# Altium schematic sheet MCU.SchDoc: Localisation sous marine
size A4; Author: Ali Zoubir; CompanyName: ETML-ES; Engineer: Ali Zoubir; Organization: ETML-ES; Revision: 0.0; SheetNumber: 2; SheetTotal: 6
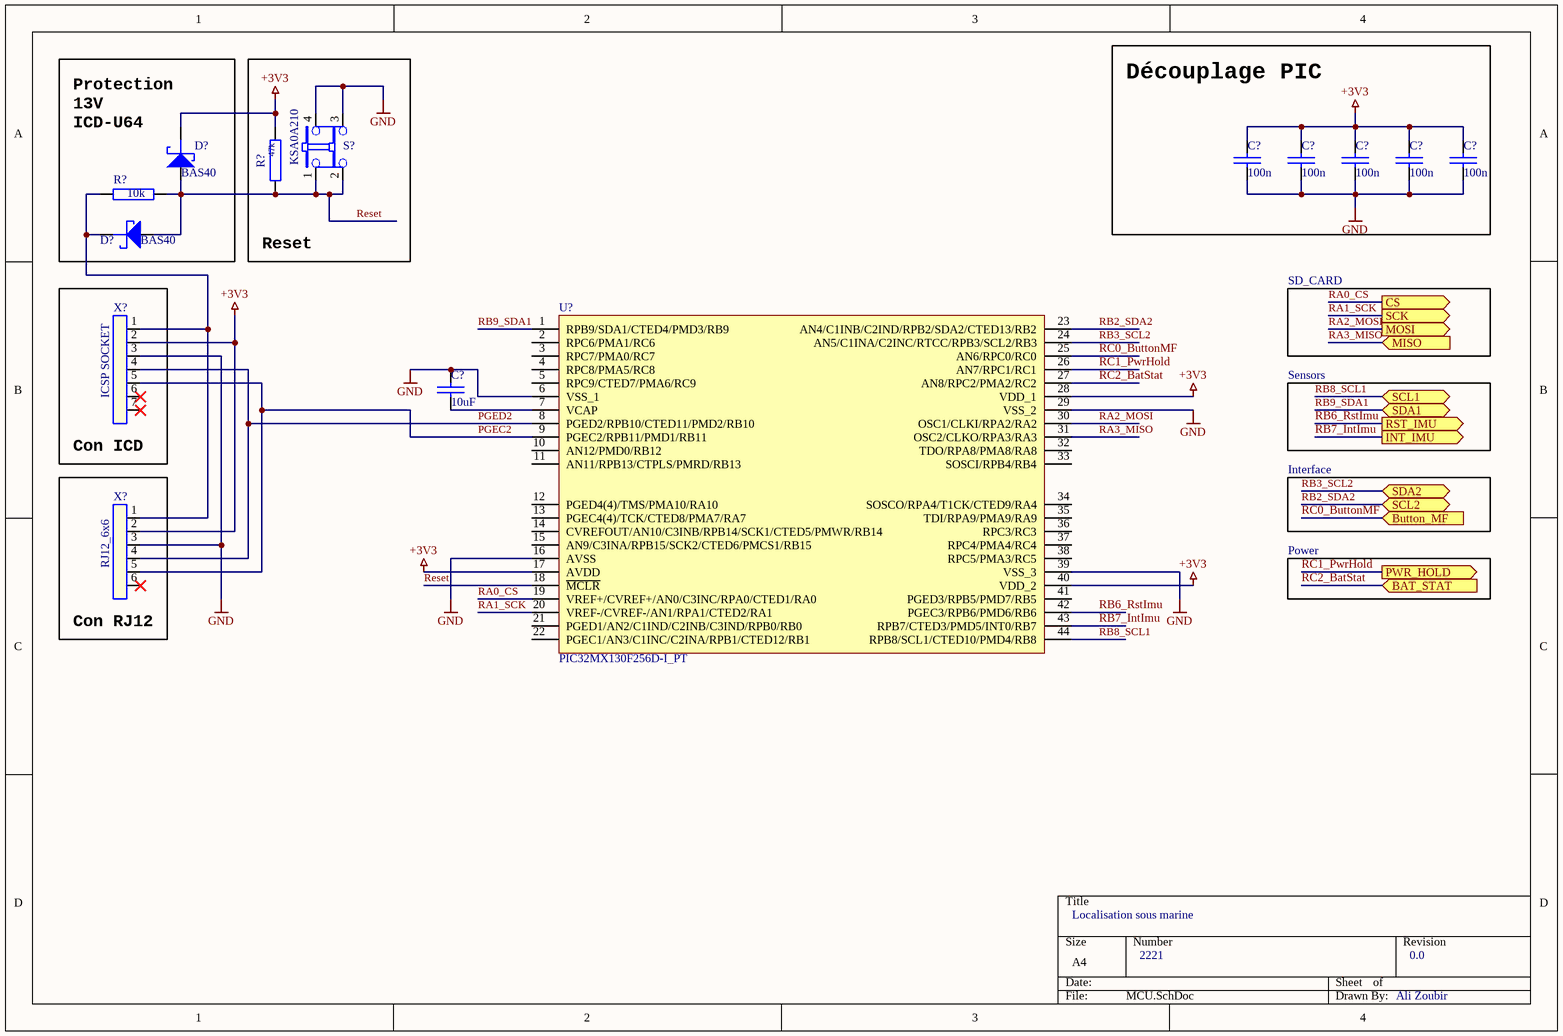
[diagram p0: MCU.SchDoc]

## Parts
(Parts that share a designator on the sheet are numbered #1, #2 ... from top to bottom, then left to right.)
C?#1  100n  [RC0805]
C?#2  100n  [RC0805]
C?#3  100n  [RC0805]
C?#4  100n  [RC0805]
C?#5  100n  [RC0805]
C?#6  10uF  [RC0805]
D?#1  BAS40  [BAS40]
D?#2  BAS40  [BAS40]
R?#1  47k  [RC0805]
R?#2  10k  [RC0805]
S?  KSA0A210  [6x6_mm_SMD_WS-TASV]
U?  PIC32MX130F256D-I_PT  [QFP80P1200X1200X120-44N]
X?#1  ICSP SOCKET  [Mini-berg1x7]
X?#2  RJ12_6x6  [RJ12_66_coude_verr_bas]

## Blocks framed on the sheet
Reset: R?#1 S?
Découplage PIC: C?#1-C?#5
Con ICD: X?#1
Con RJ12: X?#2

## Ports
BAT_STAT (in, see SchemaBloc[2B]), Button_MF (in, see SchemaBloc[3B], Interface[1A]), CS (out, see SchemaBloc[3B]), INT_IMU (out, see SchemaBloc[3B]), MISO (in, see SchemaBloc[3B]), MOSI (out, see SchemaBloc[3B]), PWR_HOLD (out, see SchemaBloc[2A]), RST_IMU (out, see SchemaBloc[3B]), SCK (out, see SchemaBloc[3B]), SCL1 (bidir, see SchemaBloc[3A]), SCL2 (bidir, see SchemaBloc[3B], Interface[1A]), SDA1 (bidir, see SchemaBloc[3A]), SDA2 (bidir, see SchemaBloc[3B], Interface[1A])

## Nets
+3V3: C?#1.1 C?#2.1 C?#3.1 C?#4.1 C?#5.1 D?#1.3(K) R?#1.1 U?.17(AVDD) U?.28(VDD_1) U?.40(VDD_2) X?#1.2 X?#2.2
GND: C?#1.2 C?#2.2 C?#3.2 C?#4.2 C?#5.2 C?#6.1 S?.3 S?.4 U?.6(VSS_1) U?.16(AVSS) U?.29(VSS_2) U?.39(VSS_3) X?#1.3 X?#2.3
PGEC2: U?.9(PGEC2/RPB11/PMD1/RB11) X?#1.5 X?#2.5
PGED2: U?.8(PGED2/RPB10/CTED11/PMD2/RB10) X?#1.4 X?#2.4
RA0_CS: U?.19(VREF+/CVREF+/AN0/C3INC/RPA0/CTED1/RA0) ; port CS
RA1_SCK: U?.20(VREF-/CVREF-/AN1/RPA1/CTED2/RA1) ; port SCK
RA2_MOSI: U?.30(OSC1/CLKI/RPA2/RA2) ; port MOSI
RA3_MISO: U?.31(OSC2/CLKO/RPA3/RA3) ; port MISO
RB2_SDA2: U?.23(AN4/C1INB/C2IND/RPB2/SDA2/CTED13/RB2) ; port SCL2
RB3_SCL2: U?.24(AN5/C1INA/C2INC/RTCC/RPB3/SCL2/RB3) ; port SDA2
RB6_RstImu: U?.42(PGEC3/RPB6/PMD6/RB6) ; port RST_IMU
RB7_IntImu: U?.43(RPB7/CTED3/PMD5/INT0/RB7) ; port INT_IMU
RB8_SCL1: U?.44(RPB8/SCL1/CTED10/PMD4/RB8) ; port SCL1
RB9_SDA1: U?.1(RPB9/SDA1/CTED4/PMD3/RB9) ; port SDA1
RC0_ButtonMF: U?.25(AN6/RPC0/RC0) ; port Button_MF
RC1_PwrHold: U?.26(AN7/RPC1/RC1) ; port PWR_HOLD
RC2_BatStat: U?.27(AN8/RPC2/PMA2/RC2) ; port BAT_STAT
Reset: D?#1.1(A) D?#2.1(A) R?#1.2 R?#2.2 S?.1 S?.2 U?.18(~{MCLR})
NetC?#6_2: C?#6.2 U?.7(VCAP)
NetD?#2_3: D?#2.3(K) R?#2.1 X?#1.1 X?#2.1

Not connected (* = marked no-connect by the designer): U? 2(RPC6/PMA1/RC6) 3(RPC7/PMA0/RC7) 4(RPC8/PMA5/RC8) 5(RPC9/CTED7/PMA6/RC9) 10(AN12/PMD0/RB12) 11(AN11/RPB13/CTPLS/PMRD/RB13) 12(PGED4(4)/TMS/PMA10/RA10) 13(PGEC4(4)/TCK/CTED8/PMA7/RA7) 14(CVREFOUT/AN10/C3INB/RPB14/SCK1/CTED5/PMWR/RB14) 15(AN9/C3INA/RPB15/SCK2/CTED6/PMCS1/RB15) 21(PGED1/AN2/C1IND/C2INB/C3IND/RPB0/RB0) 22(PGEC1/AN3/C1INC/C2INA/RPB1/CTED12/RB1) 32(TDO/RPA8/PMA8/RA8) 33(SOSCI/RPB4/RB4) 34(SOSCO/RPA4/T1CK/CTED9/RA4) 35(TDI/RPA9/PMA9/RA9) 36(RPC3/RC3) 37(RPC4/PMA4/RC4) 38(RPC5/PMA3/RC5) 41(PGED3/RPB5/PMD7/RB5); X?#1 6* 7*; X?#2 6*

## Notes on the sheet
- (near D?#1) Protection
  13V
  ICD-U64
- SD_CARD
- Sensors
- Interface
- Power
- 2221

## Library data of the parts
C?#1-C?#6 = C: SDTSourceLibName: C:\WINDOWS\TEMP\DA.LIB; PCB Footprint: RC0805
D?#1 D?#2 = BAS40_0: NC: 2; PCB Footprint: BAS40
R?#1 = R: SDTSourceLibName: N:\APP\ORCADWIN\EXPRESS\LIBRARY\ETML_LIB\R_FILMME; COMPSIDE: TOP; COMPLOC: [850.000,-625.000]; COMPROT: 270; COMPGROUP: 0; COMPFIXED: NO; COMPHEIGHT: 0.000; PCB Footprint: RC0805; COMPLOCKED: NO; COMPKEY: NO; DECOUPLER: NO; MEMORY: NO
R?#2 = R: SDTSourceLibName: N:\APP\ORCADWIN\EXPRESS\LIBRARY\ETML_LIB\R_FILMME; COMPHEIGHT: 0.000; MEMORY: NO; COMPGROUP: 0; COMPROT: 270; COMPLOC: [4375.000,-300.000]; COMPSIDE: TOP; PCB Footprint: RC0805; DECOUPLER: NO; COMPKEY: NO; COMPLOCKED: NO; COMPFIXED: NO
U? = PIC32MX130F256D-I_PT: Microchip PIC32MX130F256D-I/PT, 32bit PIC Microcontroller, 40MHz, 256 kB Flash, 44-Pin TQFP; Geometry.Height: 1.2mm; Mouser Part Number: 579-MX130F256DIPT; Mouser Price/Stock: https://www.mouser.co.uk/ProductDetail/Microchip-Technology/PIC32MX130F256D-I-PT?qs=XR%2FfMt4sL%252BEhDQElh0Q%2FjQ%3D%3D; Manufacturer_Name: Microchip; Manufacturer_Part_Number: PIC32MX130F256D-I/PT; Datasheet Link: https://componentsearchengine.com/Datasheets/5/PIC32MX130F256D-I_PT.pdf
X?#1 = Berg 7p: COMPSIDE: TOP; COMPLOC: [5575.000,-150.000]; COMPROT: 0; COMPFIXED: NO; COMPHEIGHT: 10.000; COMPGROUP: 0; COMPLOCKED: NO; COMPKEY: NO; DECOUPLER: NO; MEMORY: NO; PCB Footprint: Mini-berg1x7
X?#2 = RJ12: COMPSIDE: TOP; COMPLOC: [5225.000,-550.000]; COMPROT: 0; COMPFIXED: NO; COMPHEIGHT: 0.000; COMPGROUP: 0; COMPLOCKED: NO; COMPKEY: NO; DECOUPLER: NO; MEMORY: NO; PCB Footprint: RJ12_66_coude_verr_bas
S? = KSA0A210: PCB Footprint: 6x6_mm_SMD_WS-TASV